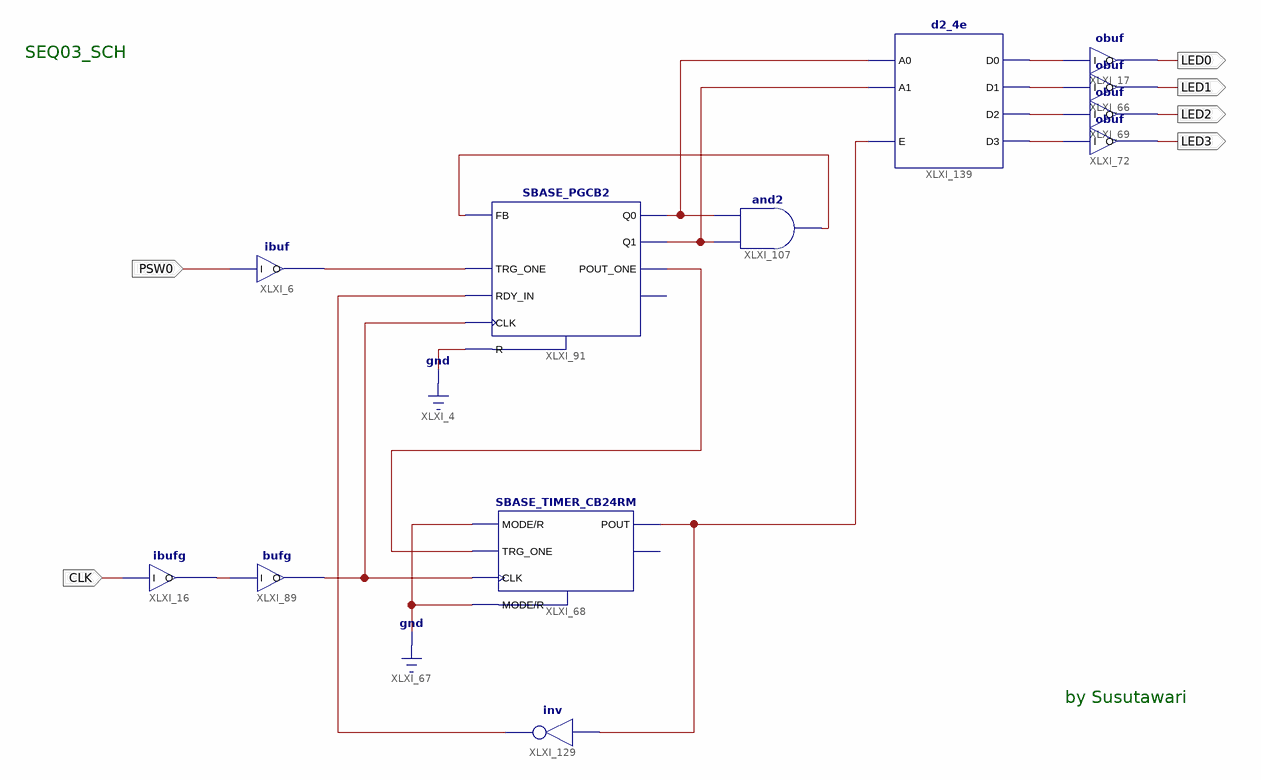
[diagram p0: schematic sheet 1]
// Xilinx ISE schematic SEQ03_SCH.sch (spartan3e) as structural Verilog: 12 symbols, 6 ports
module SEQ03_SCH (
  input  CLK,
  input  PSW0,
  output LED0,
  output LED1,
  output LED2,
  output LED3
);

  wire XLXN_160, XLXN_194, XLXN_228, XLXN_229, XLXN_243, XLXN_253, XLXN_261, XLXN_262, XLXN_557, XLXN_585,
       XLXN_586, XLXN_587, XLXN_588;

  SBASE_TIMER_CB24RM XLXI_68 (
    .CLK(XLXN_557), .TRG_ONE(XLXN_228), .MODE(1'b0), .POUT(XLXN_253), .R(1'b0));  // open: RDY_ONE
  SBASE_PGCB2 XLXI_91 (
    .FB(XLXN_194), .R(1'b0), .CLK(XLXN_557), .TRG_ONE(XLXN_243), .RDY_IN(XLXN_229), .Q0(XLXN_261),
    .Q1(XLXN_262), .POUT_ONE(XLXN_228));  // open: RDY
  not XLXI_129 (XLXN_229, XLXN_253);
  ibuf XLXI_6 (.I(PSW0), .O(XLXN_243));
  bufg XLXI_89 (.I(XLXN_160), .O(XLXN_557));
  ibufg XLXI_16 (.I(CLK), .O(XLXN_160));
  and XLXI_107 (XLXN_194, XLXN_262, XLXN_261);
  d2_4e XLXI_139 (
    .A0(XLXN_261), .A1(XLXN_262), .E(XLXN_253), .D0(XLXN_588), .D1(XLXN_587), .D2(XLXN_586), .D3(XLXN_585));
  obuf XLXI_17 (.I(XLXN_588), .O(LED0));
  obuf XLXI_66 (.I(XLXN_587), .O(LED1));
  obuf XLXI_69 (.I(XLXN_586), .O(LED2));
  obuf XLXI_72 (.I(XLXN_585), .O(LED3));

  // Notes on the sheet:
  //   SEQ03_SCH
  //   by Susutawari
endmodule
